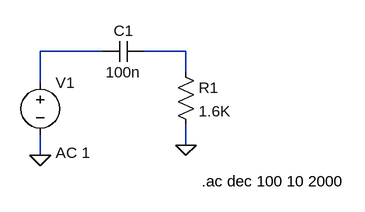
[diagram p0: schematic high_pass-filter.asc]
high_pass-filter.asc, the LTspice schematic file:
Version 4.1
SHEET 1 880 680
WIRE 128 64 32 64
WIRE 256 64 192 64
WIRE 256 96 256 64
WIRE 32 112 32 64
WIRE 256 208 256 176
WIRE 32 224 32 192
FLAG 32 224 0
FLAG 256 208 0
SYMBOL voltage 32 96 R0
WINDOW 123 24 124 Left 2
WINDOW 39 0 0 Left 0
SYMATTR InstName V1
SYMATTR Value ""
SYMATTR Value2 AC 1
SYMBOL res 240 80 R0
SYMATTR InstName R1
SYMATTR Value 1.6K
SYMBOL cap 192 48 R90
WINDOW 0 0 32 VBottom 2
WINDOW 3 32 32 VTop 2
SYMATTR InstName C1
SYMATTR Value 100n
TEXT 280 264 Left 2 !.ac dec 100 10 2000

The netlist it stands for:
* high_pass-filter.asc
V1 N001 0 AC 1
R1 N002 0 1.6K
C1 N002 N001 100n
.ac dec 100 10 2000
.backanno
.end